# Altium schematic sheet 12-LCD背光驱动_BIT3251.SchDoc
size A4; DocumentNumber: 31; SheetNumber: 31; SheetTotal: 34
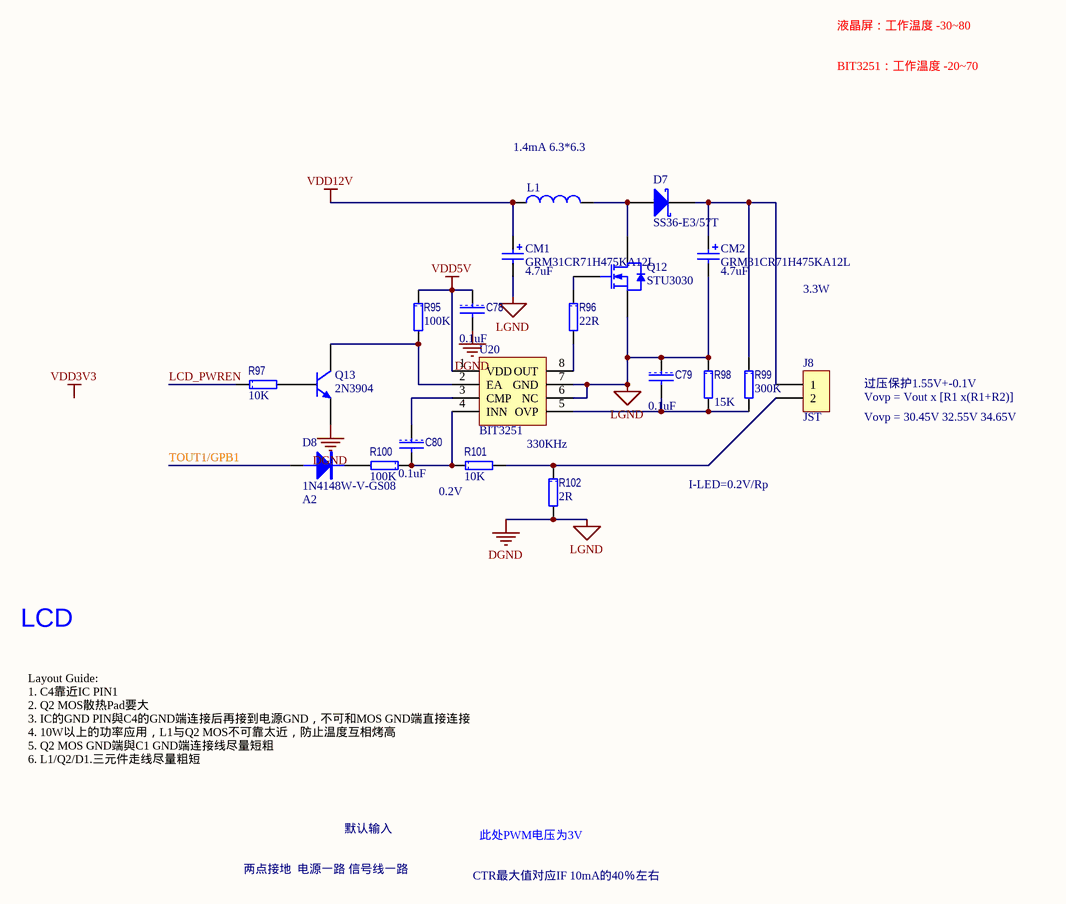
[diagram p0: 12-LCD背光驱动_BIT3251.SchDoc]

## Parts
C78  value 0.1uF  [1608[0603]C]  (hidden comment: C1608X7R1H104K)
C79  value 0.1uF  [1608[0603]C]  (hidden comment: C1608X7R1H104K)
C80  value 0.1uF  [1608[0603]C]  (hidden comment: C1608X7R1H104K)
CM1  GRM31CR71H475KA12L  value 4.7uF  [3216[1206]C]
CM2  GRM31CR71H475KA12L  value 4.7uF  [3216[1206]C]
D7  SS36-E3/57T  [DO-214AB/SMC]
D8  1N4148W-V-GS08  value A2  [SOD123]
J8  JST  [JST]
L1  SLF6045T-220M1R1-3PF  [INDP5050X28N]  (value not drawn)
Q12  STU3030  [TO-252AA_N]
Q13  2N3904  [SOT23_N]
R95  value 100K  [1608[0603]R]  (hidden comment: CRCW0603300KFKEA)
R96  value 22R  [1608[0603]R]  (hidden comment: CRCW060322R0FKEA)
R97  value 10K  [1608[0603]R]  (hidden comment: CRCW060310K0FKEA)
R98  value 15K  [1608[0603]R]  (hidden comment: CRCW060315K0FKEA)
R99  value 300K  [1608[0603]R]  (hidden comment: CRCW0603300KFKEA)
R100  value 100K  [1608[0603]R]  (hidden comment: CRCW0603300KFKEA)
R101  value 10K  [1608[0603]R]  (hidden comment: CRCW060310K0FKEA)
R102  value 2R  [1608[0603]R]  (hidden comment: CRCW06032R00FKEA)
U20  BIT3251  [SOIC8_N]

## Nets
DGND: C78.2 C79.1 CM1.2 CM2.2 Q12.3(S) Q13.1(E) R98.1 R102.2 U20.6(NC) U20.7(GND)  [also labelled LGND]
VDD5V: C78.1 R95.1 U20.1(VDD)
VDD12V: CM1.1 L1.1
LCD_PWREN: R97.1
TOUT1/GPB1: D8.1(A)
NetC79_2: C79.2 R98.2 R99.2 U20.5(OVP)
NetC80_1: C80.1 U20.3(CMP)
NetC80_2: C80.2 R100.1 R101.1 U20.4(INN)
NetCM2_1: CM2.1 D7.2(K) J8.1 R99.1
NetD7_1: D7.1(A) L1.2 Q12.4(D)
NetD8_2: D8.2(K) R100.2
NetJ8_2: J8.2 R101.2 R102.1
NetQ12_1: Q12.1(G) R96.1
NetQ13_2: Q13.2(B) R97.2
NetQ13_3: Q13.3(C) R95.2 U20.2(EA)
NetR96_2: R96.2 U20.8(OUT)

## Notes on the sheet
- 液晶屏：工作温度 -30~80
- BIT3251：工作温度 -20~70
- (near L1) 1.4mA 6.3*6.3
- 3.3W
- 过压保护1.55V+-0.1V
- 330KHz
- Vovp = 30.45V 32.55V 34.65V
- Vovp = Vout x [R1 x(R1+R2)]
- (near R101) 0.2V
- I-LED=0.2V/Rp
- LCD
- Layout Guide:
  1. C4靠近IC PIN1
  2. Q2 MOS散热Pad要大
  3. IC的GND PIN與C4的GND端连接后再接到电源GND，不可和MOS GND端直接连接
  4. 10W以上的功率应用，L1与Q2 MOS不可靠太近，防止温度互相烤高
  5. Q2 MOS GND端與C1 GND端连接线尽量短粗
  6. L1/Q2/D1.三元件走线尽量粗短
- 两点接地  电源一路 信号线一路
- 默认输入
- 此处PWM电压为3V
- CTR最大值对应IF 10mA的40％左右
- Labels drawn without touching a wire or pin: VDD3V3

## Library data of the parts
C78-C80 = CAP: 多层陶瓷电容器MLCC - SMD/SMT 0603 0.1uF 50volts X7R 10%; Manufacturer: TDK; 尺寸: 0.8 mm W x 1.6 mm L x 0.8 mm H; 工作温度范围: - 55 C to + 125 C; 封装 / 箱体: 0603 (1608 metric); 封装: Reel; 产品: General Type MLCCs; 系列: C; 电压额定值: 50 V; 电容-nF: 100 nF; 电容-pF: 100000 pF; 外壳代码 - in: 0603; 外壳代码 - mm: 1608; 产品种类: Low & Medium Capacitance SMD Ceramic Chip Capacitors; 标准包装数量: 4000; Supplier 1: Mouser; Supplier Part Number 1: 810-C1608X7R1H104K; Manufacturer Part Number: C1608X7R1H104K; RoHS: RoHS Compliant; Description 1: 多层陶瓷电容器MLCC - SMD/SMT 0603 0.1uF 50volts X7R 10%; Category: 多层陶瓷电容器MLCC - SMD/SMT; Stock 1: 224604; Pricing 1: 1=0.160, 50=0.070, 100=0.036, 500=0.019, 1000=0.013, 4000=0.010, 8000=0.009, 12000=0.008, 20000=0.007 (USD); 电容: 0.1 uF; 端接类型: SMD/SMT; 容差: 10 %; 制造商: TDK; 温度系数/代码: X7R; RoHS - 贸泽: Y; Minimum Order Quantity: 1; Reeling: True; ComponentLink1URL: http://www.tdk.com/pdf/general_B11.pdf; ComponentLink1Description: http://www.tdk.com/pdf/general_B11.pdf
CM1 CM2 = Cap Pol2: 多层陶瓷电容器MLCC - SMD/SMT 4.7uF 50Volts 10%; Manufacturer: Murata Electronics; 尺寸: 1.6 mm W x 3.2 mm L x 1.6 mm H; 工作温度范围: - 55 C to + 125 C; 封装 / 箱体: 1206 (3216 metric); 封装: Reel; 产品: General Type MLCCs; 系列: GRM; 电压额定值: 50 V; 电容-nF: 4700 nF; 外壳代码 - in: 1206; 外壳代码 - mm: 3216; 制造商: Murata; 标准包装数量: 2000; 温度系数/代码: X7R; Supplier 1: Mouser; Supplier Part Number 1: 81-GRM31CR71H475KA2L; Manufacturer Part Number: GRM31CR71H475KA12L; RoHS: RoHS Compliant; Description 1: 多层陶瓷电容器MLCC - SMD/SMT 4.7uF 50Volts 10%; Category: 多层陶瓷电容器MLCC - SMD/SMT; Stock 1: 57549; Pricing 1: 1=0.890, 10=0.561, 100=0.338, 1000=0.309, 2000=0.194, 10000=0.191, 24000=0.187, 50000=0.183 (USD); 电容: 4.7 uF; 端接类型: SMD/SMT; 容差: 10 %; RoHS - 贸泽: Y; Minimum Order Quantity: 1; Reeling: True; ComponentLink1URL: http://www.mouser.com/ds/2/281/product-244798.pdf; ComponentLink1Description: http://www.mouser.com/ds/2/281/product-244798.pdf
D7 = D Schottky: 肖特基二极管与整流器 3.0 Amp 60 Volt; Manufacturer: Vishay Semiconductors; 配置: Single; 工作温度范围: - 55 C to + 150 C; 封装 / 箱体: SMC (DO-214AB); 封装: Reel; 产品: Schottky Rectifiers; 正向连续电流: 3 A; 最大浪涌电流: 100 A; 安装风格: SMD/SMT; 正向电压下降: 0.75 V; 制造商: Vishay; 最大反向漏泄电流: 500 uA; 峰值反向电压: 60 V; 标准包装数量: 850; Supplier 1: Mouser; Supplier Part Number 1: 625-SS36-E3; Manufacturer Part Number: SS36-E3/57T; RoHS: RoHS Compliant By Exemption; Description 1: 肖特基二极管与整流器 3.0 Amp 60 Volt; Category: 肖特基二极管与整流器; Stock 1: 481; Pricing 1: 1=0.280, 10=0.250, 100=0.188, 250=0.154, 500=0.144, 850=0.144, 1000=0.139, 2000=0.131 (USD); 产品种类: Schottky Rectifiers; RoHS - 贸泽: E; Minimum Order Quantity: 1; Reeling: True; ComponentLink1URL: http://www.mouser.com/ds/2/427/88751-106389.pdf; ComponentLink1Description: http://www.mouser.com/ds/2/427/88751-106389.pdf
D8 = 1N4148W: 二极管 - 通用，功率，开关 100V Io/150mA; Manufacturer: Vishay Semiconductors; 配置: Single; 工作温度范围: - 65 C to + 150 C; 封装 / 箱体: SOD-123; 封装: Reel; 产品: Switching Diodes; 正向连续电流: 0.15 A; 最大浪涌电流: 0.5 A; 安装风格: SMD/SMT; 恢复时间: 4 ns; 正向电压下降: 1.2 V; 制造商: Vishay; 最大二极管电容: 4 pF; 最大工作温度: + 150 C; 最大功率耗散: 350 mW; 最大反向漏泄电流: 5 uA; 最小工作温度: - 65 C; 标准包装数量: 15000; Supplier 1: Mouser; Supplier Part Number 1: 625-1N4148W-V; Manufacturer Part Number: 1N4148W-V-GS08; RoHS: RoHS Compliant; Category: 二极管 - 通用，功率，开关; Stock 1: 404148; Pricing 1: 1=0.090, 10=0.083, 50=0.072, 100=0.068, 500=0.032, 1000=0.026, 3000=0.021, 9000=0.016, 10000=0.016, 18000=0.014 (USD); 峰值反向电压: 100 V; 产品种类: Switching Diodes; RoHS - 贸泽: Y; Minimum Order Quantity: 1; Reeling: True; ComponentLink1URL: http://www.mouser.com/ds/2/427/1n4148w--240387.pdf; ComponentLink1Description: http://www.mouser.com/ds/2/427/1n4148w--240387.pdf; Description 1: 二极管 - 通用，功率，开关 100V Io/150mA
J8 = CON2: CON
L1 = Inductor: 固定电感器 SMD Power Inductor
Q12 = BSN254: NMOS; Published: 17-Sep-2003; LatestRevisionDate: 12-Dec-2006; LatestRevisionNote: Footprint pad layout fixed.; DatasheetVersion: 19-Feb-2002; PackageVersion: Mar-1998; PackageReference: SOT54_variant; Publisher: Altium Limited; PackageDescription: Plastic single-ended leaded (through hole) package; 3 leads on-circle; Code_JEITA: SC-43; Code_JEDEC: TO-92 Variant; ComponentLink1Description: Manufacturer Link; ComponentLink1URL: http://www.semiconductors.philips.com/; ComponentLink2Description: Datasheet; ComponentLink2URL: http://www.semiconductors.philips.com/acrobat/datasheets/BSN254_BSN254A_3.pdf
Q13 = 2N3904: NPN General Purpose Amplifier; Published: 8-Jun-2000; LatestRevisionDate: 15-Jan-2003; LatestRevisionNote: PCB Footprint 'BCY-W3/D4.7' replaced; DatasheetVersion: 1997; PackageVersion: Sep-1998; PackageReference: TO-92A; Publisher: Altium Limited; PackageDescription: TO, Flat Index; 3 In-Line, Axial Leads; Body Dia. 4.5mm; Leads 0.51 x 0.48 mm (max); ComponentLink1Description: Manufacturer Link; ComponentLink1URL: http://www.fairchildsemi.com/; ComponentLink2Description: Datasheet; ComponentLink2URL: http://www.fairchildsemi.com/ds/2N%2F2N3904.pdf
R95 R99 R100 = RES: 厚膜电阻器 - SMD 1/10watt 300Kohms 1%; Manufacturer: Vishay / Dale; 尺寸: 0.85 mm W x 1.55 mm L x 0.45 mm H; 工作温度范围: - 55 C to + 155 C; 封装 / 箱体: 0603 (1608 metric); 封装: Reel; 功率额定值: 100 mW; 产品: Thick Film Resistors SMD; 系列: CRCW; 温度系数: 100 PPM / K; 端接类型: SMD/SMT; 电压额定值: 75 V; 外壳代码 - in: 0603; 外壳代码 - mm: 1608; 制造商: Vishay; 产品种类: 0603 Thick Film Chip Resistors; 标准包装数量: 5000; Supplier 1: Mouser; Supplier Part Number 1: 71-CRCW0603-300K-E3; Manufacturer Part Number: CRCW0603300KFKEA; RoHS: RoHS Compliant By Exemption; Category: 厚膜电阻器 - SMD; Stock 1: 19604; Pricing 1: 1=0.080, 10=0.013, 100=0.010, 1000=0.008, 5000=0.005, 25000=0.004, 50000=0.003 (USD); 电阻: 300 kOhms; 容差: 1 %; RoHS - 贸泽: E; Minimum Order Quantity: 1; Reeling: True; ComponentLink1URL: http://www.mouser.com/ds/2/427/dcrcwe3-109170.pdf; ComponentLink1Description: http://www.mouser.com/ds/2/427/dcrcwe3-109170.pdf; Description 1: 厚膜电阻器 - SMD 1/10watt 300Kohms 1%
R96 = RES: 厚膜电阻器 - SMD 1/10watt 22ohms 1%; Manufacturer: Vishay / Dale; 尺寸: 0.85 mm W x 1.55 mm L x 0.45 mm H; 工作温度范围: - 55 C to + 155 C; 封装 / 箱体: 0603 (1608 metric); 封装: Reel; 功率额定值: 100 mW; 产品: Thick Film Resistors SMD; 系列: CRCW; 温度系数: 100 PPM / K; 端接类型: SMD/SMT; 电压额定值: 75 V; 制造商: Vishay; 标准包装数量: 5000; 外壳代码 - in: 0603; 外壳代码 - mm: 1608; 产品种类: 0603 Thick Film Chip Resistors; Supplier 1: Mouser; Supplier Part Number 1: 71-CRCW0603-22-E3; Manufacturer Part Number: CRCW060322R0FKEA; RoHS: RoHS Compliant By Exemption; Category: 厚膜电阻器 - SMD; Stock 1: 35802; 电阻: 22 Ohms; 容差: 1 %; Minimum Order Quantity: 1; Reeling: True; ComponentLink1URL: http://www.mouser.com/ds/2/427/dcrcwe3-109170.pdf; ComponentLink1Description: http://www.mouser.com/ds/2/427/dcrcwe3-109170.pdf; Description 1: 厚膜电阻器 - SMD 1/10watt 22ohms 1%; Pricing 1: 1=0.080, 10=0.013, 100=0.010, 1000=0.008, 5000=0.005, 25000=0.004, 50000=0.003 (USD); RoHS - 贸泽: E
R97 R101 = RES: 厚膜电阻器 - SMD 1/10watt 10Kohms 1%; Manufacturer: Vishay / Dale; 尺寸: 0.85 mm W x 1.55 mm L x 0.45 mm H; 工作温度范围: - 55 C to + 155 C; 封装 / 箱体: 0603 (1608 metric); 封装: Reel; 功率额定值: 100 mW; 产品: Thick Film Resistors SMD; 系列: CRCW; 温度系数: 100 PPM / K; 端接类型: SMD/SMT; 电压额定值: 75 V; 制造商: Vishay; 产品种类: 0603 Thick Film Chip Resistors; 标准包装数量: 5000; 外壳代码 - in: 0603; 外壳代码 - mm: 1608; Supplier 1: Mouser; Supplier Part Number 1: 71-CRCW0603-10K-E3; Manufacturer Part Number: CRCW060310K0FKEA; RoHS: RoHS Compliant By Exemption; Category: 厚膜电阻器 - SMD; Stock 1: 0; Pricing 1: 1=0.080, 10=0.013, 100=0.010, 1000=0.008, 5000=0.005, 25000=0.004, 50000=0.003 (USD); 电阻: 10 kOhms; 容差: 1 %; RoHS - 贸泽: E; Minimum Order Quantity: 1; Reeling: True; ComponentLink1URL: http://www.mouser.com/ds/2/427/dcrcwe3-109170.pdf; ComponentLink1Description: http://www.mouser.com/ds/2/427/dcrcwe3-109170.pdf; Description 1: 厚膜电阻器 - SMD 1/10watt 10Kohms 1%
R98 = RES: 厚膜电阻器 - SMD 1/10watt 15Kohms 1%; Manufacturer: Vishay / Dale; 尺寸: 0.85 mm W x 1.55 mm L x 0.45 mm H; 工作温度范围: - 55 C to + 155 C; 封装 / 箱体: 0603 (1608 metric); 封装: Reel; 功率额定值: 100 mW; 产品: Thick Film Resistors SMD; 系列: CRCW; 温度系数: 100 PPM / K; 端接类型: SMD/SMT; 电压额定值: 75 V; 外壳代码 - in: 0603; 外壳代码 - mm: 1608; 制造商: Vishay; 产品种类: 0603 Thick Film Chip Resistors; 标准包装数量: 5000; Supplier 1: Mouser; Supplier Part Number 1: 71-CRCW0603-15K-E3; Manufacturer Part Number: CRCW060315K0FKEA; RoHS: RoHS Compliant By Exemption; Description 1: 厚膜电阻器 - SMD 1/10watt 15Kohms 1%; Category: 厚膜电阻器 - SMD; Stock 1: 75064; Pricing 1: 1=0.080, 10=0.013, 100=0.010, 1000=0.008, 5000=0.005, 25000=0.004, 50000=0.003 (USD); 电阻: 15 kOhms; 容差: 1 %; RoHS - 贸泽: E; Minimum Order Quantity: 1; Reeling: True; ComponentLink1URL: http://www.mouser.com/ds/2/427/dcrcwe3-109170.pdf; ComponentLink1Description: http://www.mouser.com/ds/2/427/dcrcwe3-109170.pdf
R102 = RES: 厚膜电阻器 - SMD 1/10watt 2ohms 1%; Manufacturer: Vishay / Dale; 尺寸: 0.85 mm W x 1.55 mm L x 0.45 mm H; 工作温度范围: - 55 C to + 155 C; 封装 / 箱体: 0603 (1608 metric); 封装: Reel; 功率额定值: 100 mW; 产品: Thick Film Resistors SMD; 系列: CRCW; 温度系数: 100 PPM / K; 端接类型: SMD/SMT; 电压额定值: 75 V; 外壳代码 - in: 0603; 外壳代码 - mm: 1608; 制造商: Vishay; 产品种类: 0603 Thick Film Chip Resistors; Product Status: New at Mouser; Supplier 1: Mouser; Supplier Part Number 1: 71-CRCW06032R00FKEA; Manufacturer Part Number: CRCW06032R00FKEA; RoHS: RoHS Compliant By Exemption; Category: 厚膜电阻器 - SMD; Stock 1: 9213; Pricing 1: 1=0.080, 10=0.013, 100=0.010, 1000=0.008, 5000=0.005, 25000=0.004, 50000=0.003 (USD); 电阻: 2 Ohms; 容差: 1 %; RoHS - 贸泽: E; Minimum Order Quantity: 1; Reeling: True; ComponentLink1URL: http://www.mouser.com/ds/2/427/dcrcwe3-109170.pdf; ComponentLink1Description: http://www.mouser.com/ds/2/427/dcrcwe3-109170.pdf; Description 1: 厚膜电阻器 - SMD 1/10watt 2ohms 1%
U20 = BIT3251: IC